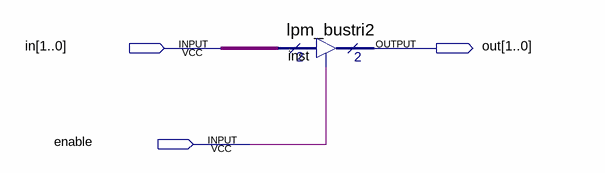
[diagram p0: schematic sheet]
// Quartus schematic testBustri1.bdf as structural Verilog: 1 symbols, 3 pins
module testBustri1 (
  input  [1:0] in,
  input  enable,
  output [1:0] out
);

  lpm_bustri2 inst (.enabledt(enable), .data(in), .tridata(out));
endmodule
